# Altium schematic sheet 驱动.SchDoc
size A4; PageSetup: Record=PageOptions|CenterHorizontal=True|CenterVertical=True|PrintScale=0.97|XCorrection=1.00|YCorrection=1.00|PrintKind=1|BorderSize=5000000|LeftOffset=0|BottomOffset=0|Orientation=2|PaperLength=1000|PaperWidth=1000|Scale=100|PaperSource=15|PrintQuality=600|MediaType=1|DitherType=10|PaperKind=A3|PrintScaleMode=1
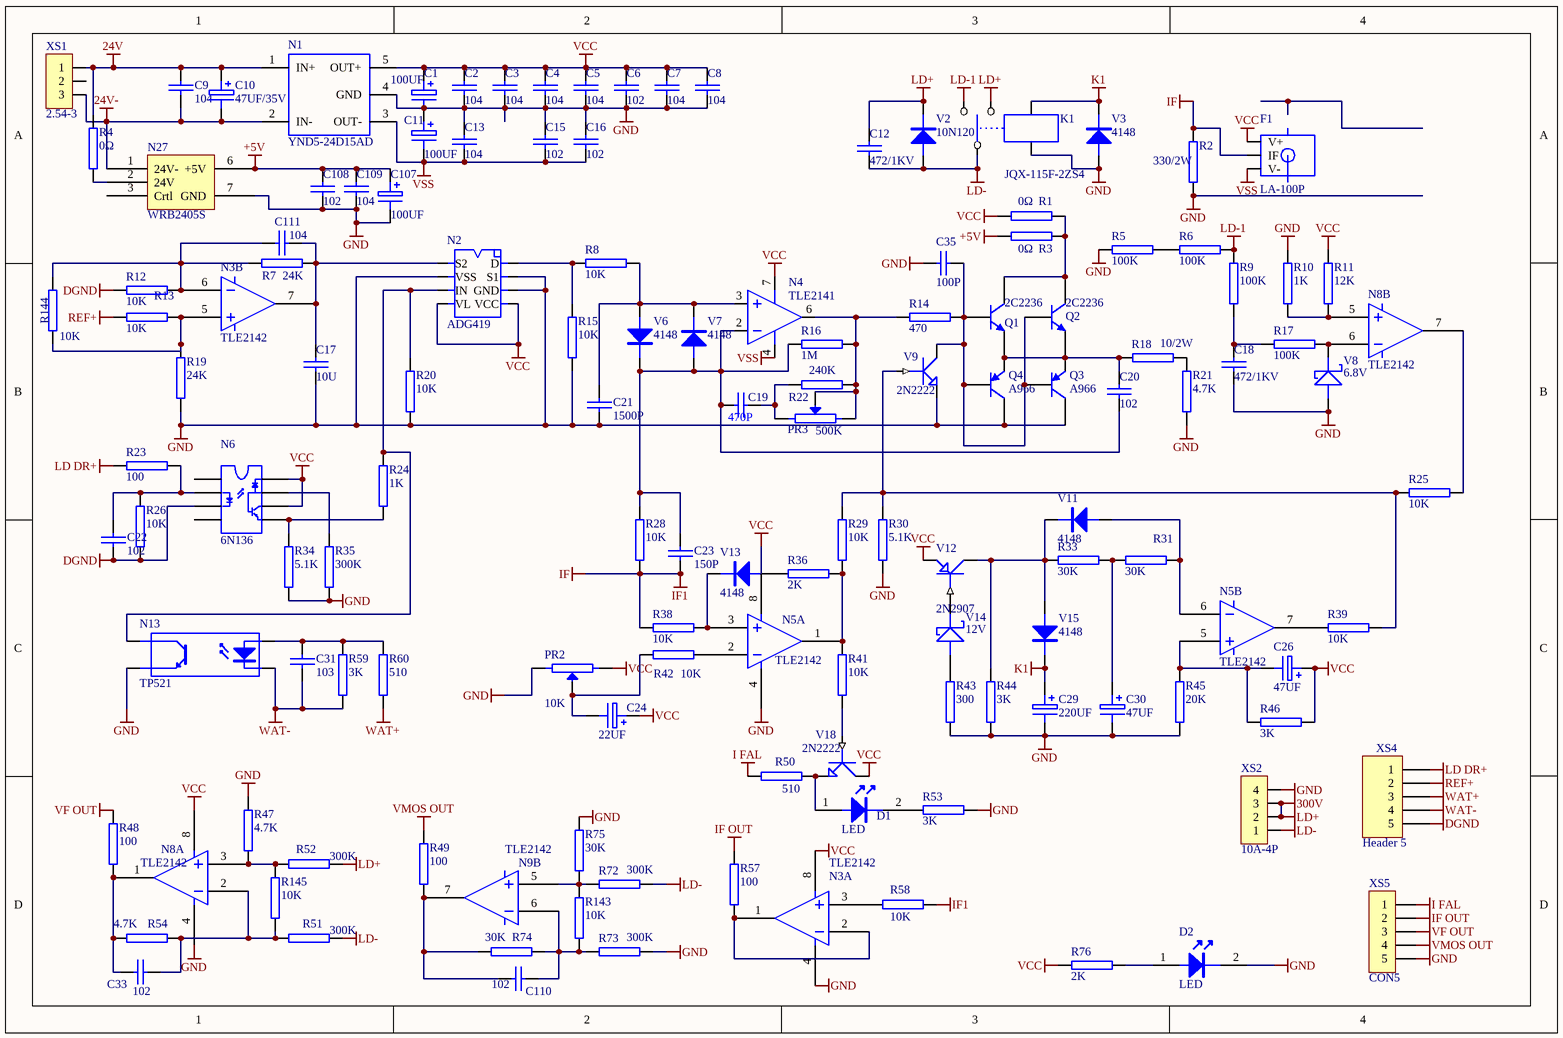
[diagram p0: 驱动.SchDoc]

## Parts
C1  100UF  [RB.1/.2]
C2  104  [0805A]
C3  104  [0805A]
C4  104  [0805A]
C5  104  [0805A]
C6  102  [0805A]
C7  104  [0805A]
C8  104  [0805A]
C9  104  [1206]
C10  47UF/35V  [RB.1/.2]
C11  100UF  [RB.1/.2]
C12  472/1KV  [RAD0.3]
C13  104  [0805A]
C15  102  [0805A]
C16  102  [0805A]
C17  10U  [0805A]
C18  472/1KV  [RAD0.2]
C19  470P  [0805A]
C20  102  [1206]
C21  1500P  [0805A]
C22  102  [0805A]
C23  150P  [0805A]
C24  22UF  [1206]
C26  47UF  [RB.1/.2]
C29  220UF  [RB.1/.2]
C30  47UF  [RB.1/.2]
C31  103  [0805A]
C33  102  [0805A]
C35  100P  [1206]
C107  100UF  [RB.1/.2]
C108  102  [0805]
C109  104  [0805]
C110  102  [0805A]
C111  104  [0805]
D1  LED  [1206A]
D2  LED  [1206a]
F1  LA-100P  [IF-1]
K1  JQX-115F-2ZS4  [JQX-115F]
N1  YND5-24D15AD  [YND5-D]
N2  ADG419  [SO-8]
N3  TLE2142  [SO-8]  (parts A,B of 2)
N4  TLE2141  [SO-8]
N5  TLE2142  [SO-8]  (parts A,B of 2)
N6  6N136  [DIP8]
N8  TLE2142  [SO-8]  (parts A,B of 2)
N9  TLE2142  [SO-8]  (part B of 2)
N13  TP521  [DIP4]
N27  WRB2405S  [WRB2405S]
PR2  10K  [3224]
PR3  500K  [3224]
Q1  2C2236  [TO-92_2]
Q2  2C2236  [TO-92_2]
Q3  A966  [TO-92_2]
Q4  A966  [TO-92_2]
R1  0Ω  [1206]
R2  330/2W  [AXIAL0.7]
R3  0Ω  [1206]
R4  0Ω  [0805A]
R5  100K  [1206]
R6  100K  [1206]
R7  24K  [0805A]
R8  10K  [0805A]
R9  100K  [1206]
R10  1K  [0805A]
R11  12K  [0805A]
R12  10K  [0805A]
R13  10K  [0805A]
R14  470  [0805A]
R15  10K  [0805A]
R16  1M  [0805A]
R17  100K  [1206]
R18  10/2W  [2W]
R19  24K  [0805A]
R20  10K  [0805A]
R21  4.7K  [0805A]
R22  240K  [0805A]
R23  100  [0805A]
R24  1K  [0805A]
R25  10K  [0805A]
R26  10K  [0805A]
R28  10K  [0805A]
R29  10K  [0805A]
R30  5.1K  [0805A]
R31  30K  [0805A]
R33  30K  [0805A]
R34  5.1K  [0805A]
R35  300K  [0805A]
R36  2K  [0805A]
R38  10K  [0805A]
R39  10K  [0805A]
R41  10K  [0805A]
R42  10K  [0805A]
R43  300  [0805A]
R44  3K  [0805A]
R45  20K  [0805A]
R46  3K  [0805A]
R47  4.7K  [0805A]
R48  100  [0805A]
R49  100  [0805]
R50  510  [0805A]
R51  300K  [1206]
R52  300K  [1206]
R53  3K  [0805A]
R54  4.7K  [0805A]
R57  100  [0805A]
R58  10K  [0805A]
R59  3K  [0805A]
R60  510  [0805A]
R72  300K  [1206]
R73  300K  [1206]
R74  30K  [0805]
R75  30K  [0805]
R76  2K  [0805]
R143  10K  [0805A]
R144  10K  [0805A]
R145  10K  [0805]
V2  10N120  [TO220D1]
V3  4148  [1206-D]
V6  4148  [1206-D]
V7  4148  [1206-D]
V8  6.8V  [1206-D]
V9  2N2222  [SOT-23]
V11  4148  [1206-D]
V12  2N2907  [SOT-23]
V13  4148  [1206-D]
V14  12V  [1206-D]
V15  4148  [1206-D]
V18  2N2222  [SOT-23]
XS1  2.54-3  [SIP3]
XS2  10A-4P  [XS10A-4P]
XS4  Header 5  [SIP-5]
XS5  CON5  [SIP-5]

## Nets
24V: C9.1 C10.1 N1.1(IN+) R4.1 XS1.1
24V-: C9.2 C10.2 N1.2(IN-) N27.1(24V-) XS1.3
300V: C12.1 K1.3 R52.2 V2.K XS2.2 XS2.3  [also labelled LD+]
+5V: C107.1 C108.1 C109.1 N27.6(+5V) R3.1
DGND: C22.1 N6.3(IN-) R12.2 R26.1 XS4.5
GND: C2.2 C3.2 C4.2 C5.2 C6.2 C7.2 C8.2 C11.1 C13.1 C15.1 C16.1 C17.2 C18.2 C21.2 C29.2 C30.2 C35.1 C107.2 C108.2 C109.2 D2.2 K1.4 N1.4(GND) N2.2(S1) N2.3(GND) N2.7(VSS) N3.4 N5.4 N8.4 N13.E N27.7(GND) PR2.1 Q3.1(C) Q4.1(C) R2.1 R5.1 R10.2 R15.1 R19.2 R20.1 R21.2 R30.2 R34.1 R35.1 R43.1 R44.2 R45.1 R47.2 R53.1 R73.2 R75.1 V3.A V8.A V9.E XS2.4
I FAL: R50.2
IF: C23.1 F1.4(IF) R2.2 R28.1 R38.2 R58.2  [also labelled IF1]
IF OUT: R57.1
K1: C29.1 K1.5 V3.K V15.K
LD DR+: R23.2 XS4.1
LD-: C12.2 K1.1 R51.2 R72.2 V2.A XS2.1
LD-1: K1.2 R6.2 R9.2
REF+: R13.2 XS4.2
VCC: C1.1 C2.1 C3.1 C4.1 C5.1 C6.1 C7.1 C8.1 C24.1 C26.1 F1.3(V+) N1.5(OUT+) N2.4(VCC) N2.5(VL) N3.8 N4.7(V+) N5.8 N6.6(VO) N6.8(VCC) N8.8 PR2.2 R1.1 R11.2 R46.1 R76.1 V12.E V18.C
VF OUT: R48.1
VMOS OUT: R49.1
VSS: C11.2 C13.2 C15.2 C16.2 F1.5(V-) N1.3(OUT-) N4.4(V-)
WAT+: R60.1 XS4.3
WAT-: C31.1 N13.K R59.2 XS4.4
NetC17_1: C17.1 C111.2 N2.8(S2) N3.7 R7.1
NetC18_1: C18.1 R9.1 R17.2
NetC19_1: C19.1 PR3.1 R22.2
NetC19_2: C19.2 C20.2 C23.2 N4.2(IN-) R16.2 R28.2 V6.K V7.A
NetC20_1: C20.1 Q1.3(E) Q2.3(E) Q3.3(E) Q4.3(E) R18.1
NetC21_1: C21.1 N4.3(IN+) R8.1 V6.A V7.K
NetC22_2: C22.2 N6.2(IN+) R23.1 R26.2
NetC24_2: C24.2 PR2.W R42.2
NetC26_2: C26.2 N5.5 R45.2 R46.2
NetC30_1: C30.1 R31.2 R33.1
NetC31_2: C31.2 N13.A R59.1 R60.2
NetC33_1: C33.1 N8.2 R51.1 R54.1 R145.2
NetC33_2: C33.2 N8.1 R48.2 R54.2
NetC35_2: C35.2 Q1.2(B) Q2.2(B) Q3.2(B) Q4.2(B) R14.1 V9.C
NetC110_1: C110.1 N9.6 R73.1 R74.1 R143.2
NetC110_2: C110.2 N9.7 R49.2 R74.2
NetC111_1: C111.1 N3.6 R7.2 R12.1 R144.1
NetD1_1: D1.1 R50.1 V18.E
NetD1_2: D1.2 R53.2
NetD2_1: D2.1 R76.2
NetN2_1: N2.1(D) R8.2 R15.2
NetN2_6: N2.6(IN) N13.C R20.2 R24.2
NetN3_1: N3.1 N3.2 R57.2
NetN3_3: N3.3 R58.1
NetN3_5: N3.5 R13.1 R19.1 R144.2
NetN4_6: N4.6(OUT) PR3.2 PR3.W R14.2 R16.1 R22.1
NetN5_1: N5.1 R29.2 R36.2 R41.2
NetN5_2: N5.2 R42.1
NetN5_3: N5.3 R38.1 V13.K
NetN5_6: N5.6 R31.1 V11.A
NetN5_7: N5.7 R39.1
NetN6_5: N6.5(GND) R24.1 R34.2
NetN6_7: N6.7(VB) R35.2
NetN8_3: N8.3 R47.1 R52.1 R145.1
NetN8_5: N8.5 R10.1 R11.1
NetN8_6: N8.6 R17.1 V8.K
NetN8_7: N8.7 R25.1
NetN9_5: N9.5 R72.1 R75.2 R143.1
NetN27_2: N27.2(24V) R4.2
NetQ1_1: Q1.1(C) Q2.1(C) R1.2 R3.2
NetR5_2: R5.2 R6.1
NetR18_0: R18.0 R21.1
NetR25_2: R25.2 R29.1 R30.1 R39.2 V9.B
NetR33_2: R33.2 R44.1 V11.K V12.C V15.A
NetR36_1: R36.1 V13.A
NetR41_1: R41.1 V18.B
NetR43_2: R43.2 V14.A
NetV12_B: V12.B V14.K

Not connected (* = marked no-connect by the designer): C1 2; N6 1(NC) 4(NC); N27 3(Crtl); XS1 2; XS5 1 2 3 4 5

## Notes on the sheet
- Labels drawn without touching a wire or pin: GND, I FAL, IF OUT, VF OUT, VMOS OUT

## Library data of the parts
C1 C10 C11 C24 C26 C29 C30 C107 = ELECTRO1
C2-C9 C12 C13 C15-C23 C31 C33 C35 C108-C111 = CAP
F1 = IF-1
K1 = RELAY-SPDT
N1 = YND5
N3 N5 N8 N9 = LM193
N4 = TLC2241
N6 = 6N137
N13 = OPTOISO1
PR2 PR3 = POT
Q1 Q2 = 2N3904: NPN General Purpose Amplifier; Published: 8-Jun-2000; LatestRevisionDate: 15-Jan-2003; LatestRevisionNote: PCB Footprint 'BCY-W3/D4.7' replaced; DatasheetVersion: 1997; PackageVersion: Sep-1998; PackageReference: TO-92A; Publisher: Altium Limited; Code_JEDEC: TO-92A; ComponentLink1Description: Manufacturer Link; ComponentLink1URL: http://www.fairchildsemi.com/; ComponentLink2Description: Datasheet; ComponentLink2URL: http://www.fairchildsemi.com/ds/2N%2F2N3904.pdf
Q3 Q4 = 2N3906: PNP General Purpose Amplifier; Published: 8-Jun-2000; LatestRevisionDate: 15-Jan-2003; LatestRevisionNote: PCB Footprint 'BCY-W3/D4.7' replaced; DatasheetVersion: 1997; PackageVersion: Sep-1998; PackageReference: TO-92A; Publisher: Altium Limited; Code_JEDEC: TO-92A; ComponentLink1Description: Manufacturer Link; ComponentLink1URL: http://www.fairchildsemi.com/; ComponentLink2Description: Datasheet; ComponentLink2URL: http://www.fairchildsemi.com/ds/2N%2F2N3906.pdf
R1-R26 R28-R31 R33-R36 R38 R39 R41-R54 R57-R60 R72-R76 R143-R145 = RES2
V2 V3 V6 V7 V11 V13 V15 = DIODE
V8 V14 = DIODE SCHOTTKY
V9 V18 = NPN1
V12 = PNP2
XS1 = CON3
XS2 = CON4
XS4 = Header 5: Header, 5-Pin; LatestRevisionDate: 17-Jul-2002; LatestRevisionNote: Re-released for DXP Platform.; Publisher: Altium Limited
XS5 = CON5: Connector